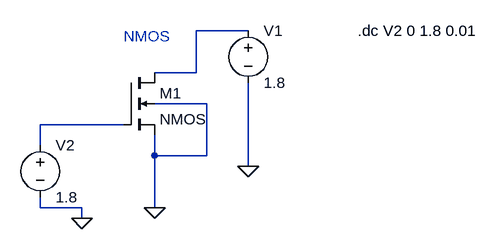
[diagram p0: schematic NMOS.asc]
NMOS.asc, the LTspice schematic file:
Version 4
SHEET 1 880 680
WIRE 336 16 256 16
WIRE 256 80 256 16
WIRE 256 80 192 80
WIRE 272 128 192 128
WIRE 144 160 16 160
WIRE 16 192 16 160
WIRE 192 208 192 176
WIRE 272 208 272 128
WIRE 272 208 192 208
WIRE 336 224 336 96
WIRE 16 288 16 272
WIRE 80 288 16 288
WIRE 192 288 192 208
WIRE 80 304 80 288
FLAG 192 288 0
FLAG 336 224 0
FLAG 80 304 0
SYMBOL nmos4 144 80 R0
SYMATTR InstName M1
SYMATTR Value2 l=180n w=500n
SYMBOL voltage 336 0 R0
WINDOW 123 0 0 Left 0
WINDOW 39 0 0 Left 0
SYMATTR InstName V1
SYMATTR Value 1.8
SYMBOL voltage 16 176 R0
WINDOW 123 0 0 Left 0
WINDOW 39 0 0 Left 0
SYMATTR InstName V2
SYMATTR Value 1.8
TEXT 144 24 Left 2 ;NMOS
TEXT 504 16 Left 2 !.dc V2 0 1.8 0.01

The netlist it stands for:
* NMOS.asc
M1 N001 N002 0 0 NMOS l=180n w=500n
V1 N001 0 1.8
V2 N002 0 1.8
.model NMOS NMOS
.model PMOS PMOS
.lib standard.mos
* NMOS
.dc V2 0 1.8 0.01
.backanno
.end